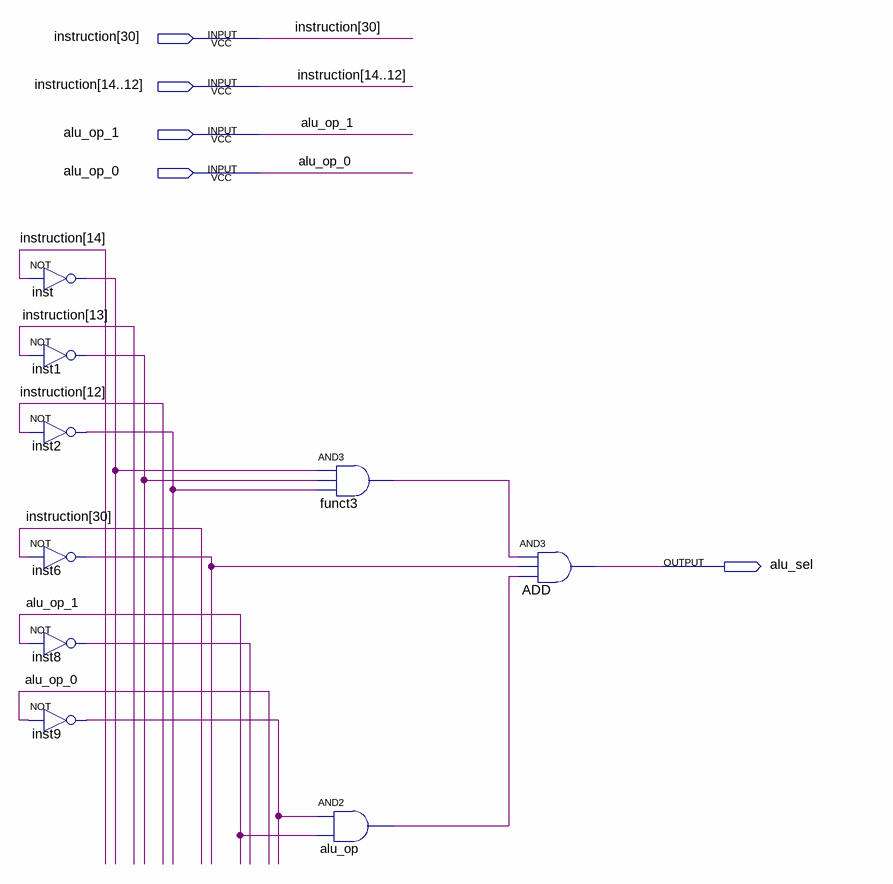
[diagram p0: schematic sheet]
// Quartus schematic Alu_Control.bdf as structural Verilog: 9 symbols, 5 pins
module Alu_Control (
  input  [30:12] instruction,
  input  alu_op_1,
  input  alu_op_0,
  output alu_sel
);

  wire alu_op_out, funct3_out, inst1_out, inst2_out, inst6_out, inst8_out, inst9_out, inst_out;

  not inst (inst_out, instruction[14]);
  not inst1 (inst1_out, instruction[13]);
  not inst2 (inst2_out, instruction[12]);
  not inst6 (inst6_out, instruction[30]);
  not inst8 (inst8_out, alu_op_1);
  not inst9 (inst9_out, alu_op_0);
  and funct3 (funct3_out, inst_out, inst1_out, inst2_out);
  and alu_op (alu_op_out, inst9_out, alu_op_1);
  and ADD (alu_sel, funct3_out, inst6_out, alu_op_out);
endmodule
